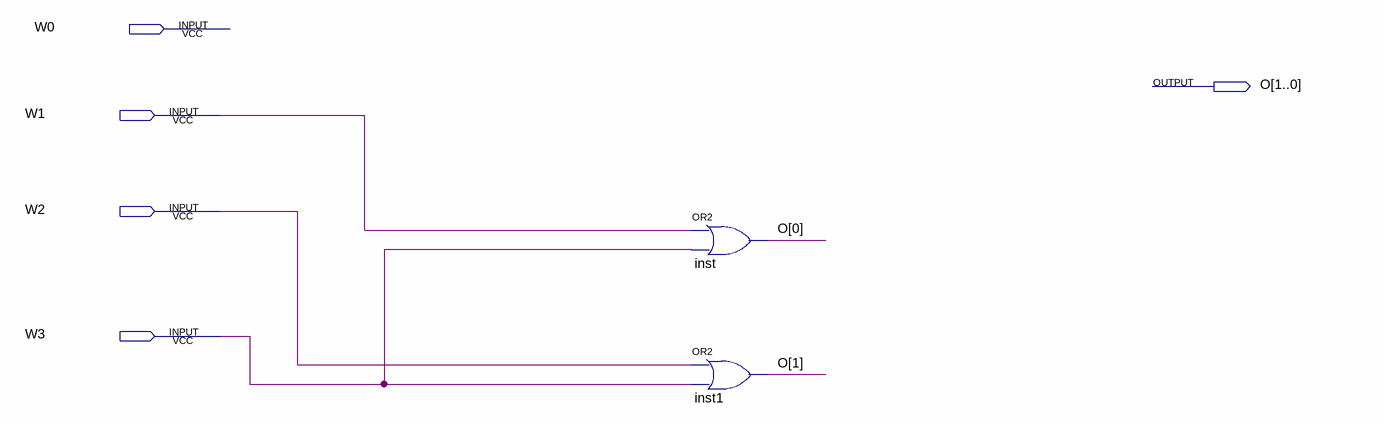
[diagram p0: schematic sheet]
// Quartus schematic Encoder4to2.bdf as structural Verilog: 2 symbols, 5 pins
module Encoder4to2 (
  input  W0,
  input  W1,
  input  W2,
  input  W3,
  output [1:0] O
);

  or inst (O[0], W1, W3);
  or inst1 (O[1], W2, W3);
endmodule
